# Altium schematic sheet 数码管.SchDoc
size A4
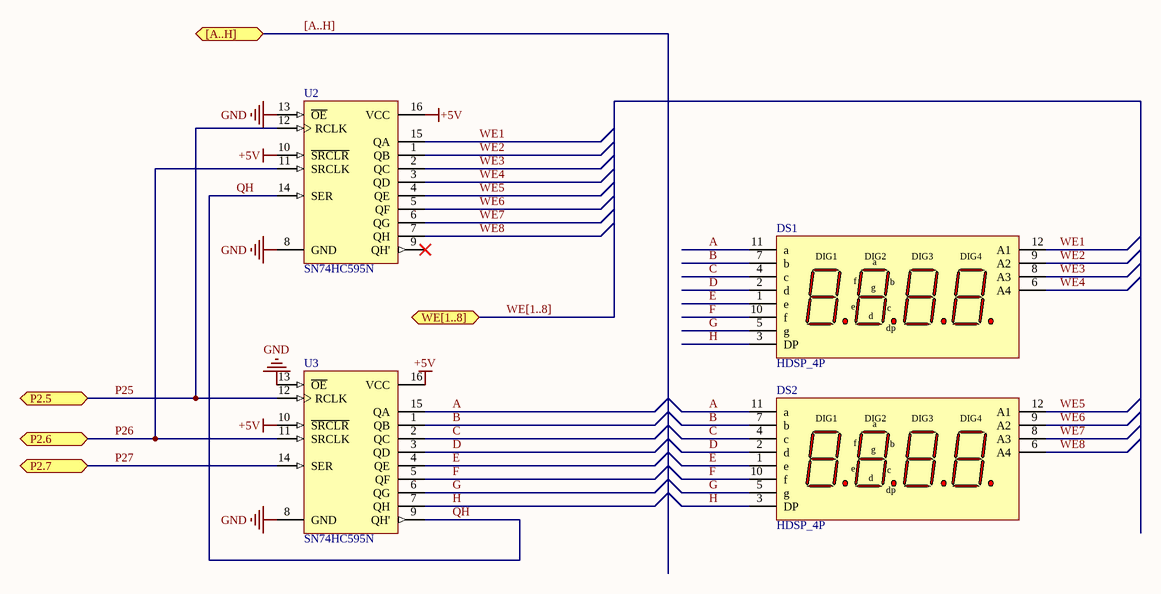
[diagram p0: 数码管.SchDoc]

## Parts
DS1  HDSP_4P  [HDSP_B4_数码管]
DS2  HDSP_4P  [HDSP_B4_数码管]
U2  SN74HC595N  [N016]
U3  SN74HC595N  [N016]

## Ports
[A..H] (bidir), P2.5 (bidir), P2.6 (bidir), P2.7 (bidir), WE[1..8] (bidir)

## Nets
+5V: U2.10(~{SRCLR}) U2.16(VCC) U3.10(~{SRCLR}) U3.16(VCC)
GND: U2.8(GND) U2.13(~{OE}) U3.8(GND) U3.13(~{OE})
A: DS1.11(a) DS2.11(a) U3.15(QA)
B: DS1.7(b) DS2.7(b) U3.1(QB)
C: DS1.4(c) DS2.4(c) U3.2(QC)
D: DS1.2(d) DS2.2(d) U3.3(QD)
E: DS1.1(e) DS2.1(e) U3.4(QE)
F: DS1.10(f) DS2.10(f) U3.5(QF)
G: DS1.5(g) DS2.5(g) U3.6(QG)
H: DS1.3(DP) DS2.3(DP) U3.7(QH)
P25: U2.12(RCLK) U3.12(RCLK) ; port P2.5
P26: U2.11(SRCLK) U3.11(SRCLK) ; port P2.6
P27: U3.14(SER) ; port P2.7
QH: U2.14(SER) U3.9(QH')
WE1: DS1.12(A1) U2.15(QA)
WE2: DS1.9(A2) U2.1(QB)
WE3: DS1.8(A3) U2.2(QC)
WE4: DS1.6(A4) U2.3(QD)
WE5: DS2.12(A1) U2.4(QE)
WE6: DS2.9(A2) U2.5(QF)
WE7: DS2.8(A3) U2.6(QG)
WE8: DS2.6(A4) U2.7(QH)

Not connected (* = marked no-connect by the designer): U2 9(QH')*

## Buses and harness runs
bus [A..H] = port [A..H]
bus WE[1..8] = port WE[1..8]

## Notes on the sheet
- 专升本
- 通信工程
- 李烨攀
- 2101班
- 210806300163
- 学号
- (in symbol HDSP_4P) DIG1; DIG2; DIG3; DIG4; dp

## Library data of the parts
U2 U3 = SN74HC595N: 8-Bit Shift Register with 3-State Output Registers; Published: 8-Jun-2000; LatestRevisionDate: 04-Mar-2005; LatestRevisionNote: Stylized 3D Model Added.; DatasheetVersion: May-1997; PackageVersion: Oct-1995; PackageReference: N016; Publisher: Altium Limited; PackageDescription: DIP; 16 Leads; Row Spacing 7.62 mm; Pitch 2.54 mm; Code_JEDEC: MS-001-BB; ComponentLink1Description: Manufacturer Link; ComponentLink1URL: http://www.ti.com/; ComponentLink2Description: Datasheet; ComponentLink2URL: http://www-s.ti.com/sc/ds/sn74hc595.pdf